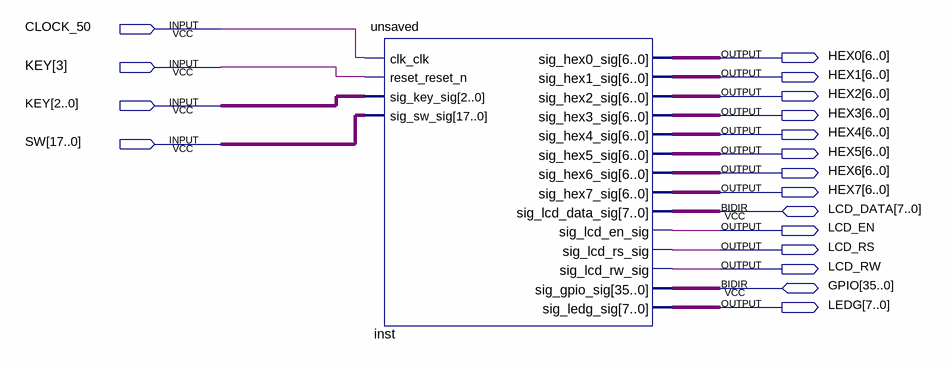
[diagram p0: schematic sheet]
// Quartus schematic register_limit_testing_mcu.bdf as structural Verilog: 1 symbols, 18 pins
module register_limit_testing_mcu (
  input  CLOCK_50,
  input  [3:0] KEY,
  input  [17:0] SW,
  inout  [7:0] LCD_DATA,
  inout  [35:0] GPIO,
  output [6:0] HEX0,
  output [6:0] HEX1,
  output [6:0] HEX2,
  output [6:0] HEX3,
  output [6:0] HEX4,
  output [6:0] HEX5,
  output [6:0] HEX6,
  output [6:0] HEX7,
  output LCD_EN,
  output LCD_RS,
  output LCD_RW,
  output [7:0] LEDG
);

  unsaved inst (
    .clk_clk(CLOCK_50), .reset_reset_n(KEY[3]), .sig_key_sig(KEY[2:0]), .sig_sw_sig(SW), .sig_hex0_sig(HEX0),
    .sig_hex1_sig(HEX1), .sig_hex2_sig(HEX2), .sig_hex3_sig(HEX3), .sig_hex4_sig(HEX4), .sig_hex5_sig(HEX5),
    .sig_hex6_sig(HEX6), .sig_hex7_sig(HEX7), .sig_lcd_en_sig(LCD_EN), .sig_lcd_rs_sig(LCD_RS),
    .sig_lcd_rw_sig(LCD_RW), .sig_ledg_sig(LEDG), .sig_lcd_data_sig(LCD_DATA), .sig_gpio_sig(GPIO));
endmodule
